# Altium schematic sheet Sheet3_MCU.SchDoc: =ProjectName
size A4; DocumentNumber: 3; SheetNumber: 3; SheetTotal: 5
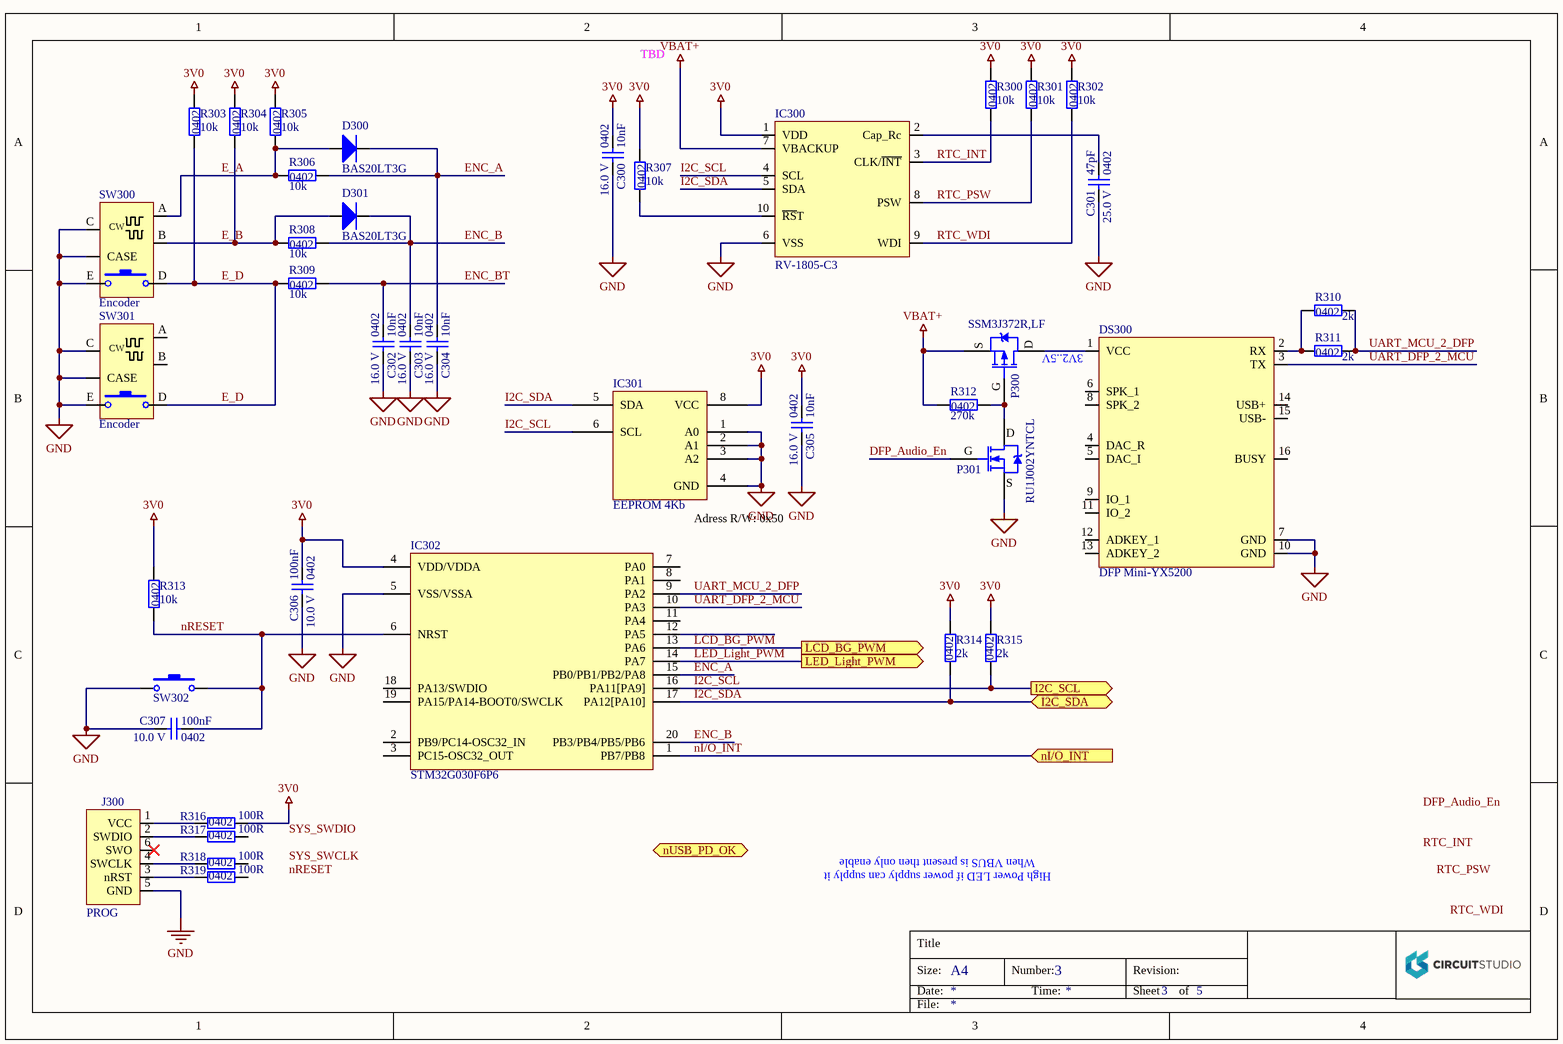
[diagram p0: Sheet3_MCU.SchDoc]

## Parts
C300  Capacitance: 10nF  Footprint: 0402  Voltage: 16.0 V  [C_0402]  (hidden comment: C 10nF 0402 16V)
C301  Capacitance: 47pF  Footprint: 0402  Voltage: 25.0 V  [C_0402]  (hidden comment: C 47pF 0402 25V)
C302  Capacitance: 10nF  Footprint: 0402  Voltage: 16.0 V  [C_0402]  (hidden comment: C 10nF 0402 16V)
C303  Capacitance: 10nF  Footprint: 0402  Voltage: 16.0 V  [C_0402]  (hidden comment: C 10nF 0402 16V)
C304  Capacitance: 10nF  Footprint: 0402  Voltage: 16.0 V  [C_0402]  (hidden comment: C 10nF 0402 16V)
C305  Capacitance: 10nF  Footprint: 0402  Voltage: 16.0 V  [C_0402]  (hidden comment: C 10nF 0402 16V)
C306  Capacitance: 100nF  Footprint: 0402  Voltage: 10.0 V  [C_0402]  (hidden comment: C 100nF 0402 10V)
C307  Capacitance: 100nF  Footprint: 0402  Voltage: 10.0 V  [C_0402]  (hidden comment: C 100nF 0402 10V)
D300  BAS20LT3G  [SOT-23-3]
D301  BAS20LT3G  [SOT-23-3]
DS300  DFP Mini-YX5200  [DFP_Player_Mini]
IC300  RV-1805-C3  [SON-6]
IC301  EEPROM 4Kb  [TSSOP-8_4.4mm]
IC302  STM32G030F6P6  [TSSOP-20]
J300  PROG  [J_TC2030-IDC-FP]
P300  Manufacturer Part Number: SSM3J372R,LF  [SOT-23-3-F]  (hidden comment: P PMOS 30V 6A)
P301  Manufacturer Part Number: RU1J002YNTCL  [UMT3F]  (hidden comment: P_NCH_50V_150mW)
R300  Resistance: 10k  Footprint: 0402  [R_0402]  (hidden comment: R 10k 0402)
R301  Resistance: 10k  Footprint: 0402  [R_0402]  (hidden comment: R 10k 0402)
R302  Resistance: 10k  Footprint: 0402  [R_0402]  (hidden comment: R 10k 0402)
R303  Resistance: 10k  Footprint: 0402  [R_0402]  (hidden comment: R 10k 0402)
R304  Resistance: 10k  Footprint: 0402  [R_0402]  (hidden comment: R 10k 0402)
R305  Resistance: 10k  Footprint: 0402  [R_0402]  (hidden comment: R 10k 0402)
R306  Resistance: 10k  Footprint: 0402  [R_0402]  (hidden comment: R 10k 0402)
R307  Resistance: 10k  Footprint: 0402  [R_0402]  (hidden comment: R 10k 0402)
R308  Resistance: 10k  Footprint: 0402  [R_0402]  (hidden comment: R 10k 0402)
R309  Resistance: 10k  Footprint: 0402  [R_0402]  (hidden comment: R 10k 0402)
R310  Resistance: 2k  Footprint: 0402  [R_0402]  (hidden comment: R 2k 0402)
R311  Resistance: 2k  Footprint: 0402  [R_0402]  (hidden comment: R 2k 0402)
R312  Resistance: 270k  Footprint: 0402  [R_0402]  (hidden comment: R 270k 0402)
R313  Resistance: 10k  Footprint: 0402  [R_0402]  (hidden comment: R 10k 0402)
R314  Resistance: 2k  Footprint: 0402  [R_0402]  (hidden comment: R 2k 0402)
R315  Resistance: 2k  Footprint: 0402  [R_0402]  (hidden comment: R 2k 0402)
R316  Resistance: 100R  Footprint: 0402  [R_0402]  (hidden comment: R 100R 0402)
R317  Resistance: 100R  Footprint: 0402  [R_0402]  (hidden comment: R 100R 0402)
R318  Resistance: 100R  Footprint: 0402  [R_0402]  (hidden comment: R 100R 0402)
R319  Resistance: 100R  Footprint: 0402  [R_0402]  (hidden comment: R 100R 0402)
SW300  Encoder  [PEC11R]
SW301  Encoder  [PEC11R]
SW302  SW  [SW_PTS810]  (value not drawn)

## Ports
I2C_SCL (out), I2C_SDA (bidir), LCD_BG_PWM (out), LED_Light_PWM (out), nI/O_INT (in), nUSB_PD_OK (in)

## Nets
3V0: C300.2 C305.2 C306.2 IC300.1(VDD) IC301.8(VCC) IC302.4(VDD/VDDA) R300.2 R301.2 R302.2 R303.2 R304.2 R305.2 R307.2 R313.2 R314.2 R315.2 R316.2
GND: C300.1 C301.1 C302.1 C303.1 C304.1 C305.1 C306.1 C307.1 DS300.7(GND) DS300.10(GND) IC300.6(VSS) IC301.1(A0) IC301.2(A1) IC301.3(A2) IC301.4(GND) IC302.5(VSS/VSSA) J300.5(GND) P301.2(S) SW300.C SW300.CASE SW300.E SW301.C SW301.CASE SW301.E SW302.1(1,_2)
VBAT+: IC300.7(VBACKUP) P300.2(S) R312.2
DFP_Audio_En: P301.1(G)
E_A: D300.1(A) R305.1 R306.1 SW300.A
E_B: D301.1(A) R304.1 R308.1 SW300.B
E_D: R303.1 R309.1 SW300.D SW301.D
ENC_A: C304.2 D300.3(K) IC302.15(PB0/PB1/PB2/PA8) R306.2
ENC_B: C303.2 D301.3(K) IC302.20(PB3/PB4/PB5/PB6) R308.2
ENC_BT: C302.2 R309.2
I2C_SCL: IC300.4(SCL) IC301.6(SCL) IC302.16(PA11[PA9]) R315.1 ; port I2C_SCL
I2C_SDA: IC300.5(SDA) IC301.5(SDA) IC302.17(PA12[PA10]) R314.1 ; port I2C_SDA
LCD_BG_PWM: IC302.13(PA6) ; port LCD_BG_PWM
LED_Light_PWM: IC302.14(PA7) ; port LED_Light_PWM
nI/O_INT: IC302.1(PB7/PB8) ; port nI/O_INT
nRESET: C307.2 IC302.6(NRST) R313.1 SW302.3(2,_3)
RTC_INT: IC300.3(CLK/~{INT}) R300.1
RTC_PSW: IC300.8(PSW) R301.1
RTC_WDI: IC300.9(WDI) R302.1
UART_DFP_2_MCU: DS300.3(TX) IC302.10(PA3)
UART_MCU_2_DFP: IC302.9(PA2) R310.1 R311.1
NetC301_2: C301.2 IC300.2(Cap_Rc)
NetDS300_1: DS300.1(VCC) P300.3(D)
NetDS300_2: DS300.2(RX) R310.2 R311.2
NetIC300_10: IC300.10(~{RS}T) R307.1
NetJ300_1: J300.1(VCC) R316.1
NetJ300_2: J300.2(SWDIO) R317.1
NetJ300_3: J300.3(nRST) R319.1
NetJ300_4: J300.4(SWCLK) R318.1
NetP300_1: P300.1(G) P301.3(D) R312.1

Not connected (* = marked no-connect by the designer): DS300 4(DAC_R) 5(DAC_I) 6(SPK_1) 8(SPK_2) 9(IO_1) 11(IO_2) 12(ADKEY_1) 13(ADKEY_2) 14(USB+) 15(USB-) 16(BUSY); IC302 2(PB9/PC14-OSC32_IN) 3(PC15-OSC32_OUT) 7(PA0) 8(PA1) 11(PA4) 12(PA5) 18(PA13/SWDIO) 19(PA15/PA14-BOOT0/SWCLK); J300 6(SWO)*; R317 2; R318 2; R319 2; SW301 A B

## Notes on the sheet
- TBD
- 3V2..5V
- Adress R/W: 0x50
- When VBUS is present then only enable
- High Power LED if power supply can supply it
- Labels drawn without touching a wire or pin: DFP_Audio_En, nRESET, RTC_INT, RTC_PSW, RTC_WDI, SYS_SWCLK, SYS_SWDIO
- Title
- Size:
- Date:
- A4
- Number:
- Time:
- Revision:
- Sheet
- of
- File:
- (in symbol ENC_12_THT) CW

## Library data of the parts
C300 C302-C305 = CAP_10nF_16V_0402: CAP CER 10000PF 16V Y5V 0402; Manufacturer: Samsung Electro-Mechanics; Manufacturer Part Number: CL05F103ZO5NNNC; Type: Capacitor; Supplier 1: Digi-Key; Supplier Part Number 1: 1276-1738-1-ND
C301 = CAP_47pF_25V_0402: CAP CER 47PF 25V C0G/NP0 0402; Manufacturer: KEMET; Manufacturer Part Number: C0402C470J3GAC7867; Type: Capacitor; Supplier 1: Digi-Key; Supplier Part Number 1: 399-C0402C470J3GAC7867CT-ND
C306 C307 = CAP_100nF_10V_0402: CAP CER 0.1UF 10V X5R 0402; Manufacturer: Samsung Electro-Mechanics; Manufacturer Part Number: CL05A104MP5NNNC; Type: Capacitor; Supplier 1: Digi-Key; Supplier Part Number 1: 1276-1443-1-ND
D300 D301 = D_LL_200V_200mA: DIODE GP 200V 200MA SOT23-3; Manufacturer: onsemi; Type: Diode; Supplier 1: Digi-Key; Supplier Part Number 1: BAS20LT3GOSCT-ND; Manufacturer Part Number: BAS20LT3G
DS300 = DFP_Player_mini: Mini-YX5200 Audio MP3 Modul; Manufacturer: DFRobot; Manufacturer Part Number: DFR0299; Type: other; Supplier 1: AliExpress; Supplier Part Number 1: 33036928283
IC300 = IC_RTC_1805-C3: IC RTC CLK/CALENDAR I2C 10SON; Manufacturer: Micro Crystal AG; Manufacturer Part Number: RV-1805-C3-32.768KHZ-2PPM-TA-QA; Type: IC, RTC; Supplier 1: Digi-Key; Supplier Part Number 1: 2195-RV-1805-C3-32.768KHZ-2PPM-TA-QATR-ND
IC301 = IC_EEPROM_4Kb: IC EEPROM 4KBIT I2C 1MHZ 8TSSOP; Manufacturer: Microchip Technology; Manufacturer Part Number: AT34C04-X5M-T; Type: IC, EEPROM; Supplier 1: Digi-Key; Supplier Part Number 1: AT34C04-X5M-TCT-ND
IC302 = IC_MCU_STM32G030F6P6: IC MCU 32BIT 32KB FLASH 20TSSOP; Manufacturer: STMicroelectronics; Manufacturer Part Number: STM32G030F6P6; Type: IC, MCU; Supplier 1: JLCPCB; Supplier Part Number 1: C724040
J300 = J_TC2030-IDC-FP: SWD Programmer; Manufacturer: Tag_connect; Manufacturer Part Number: TC2030; Type: Connector; Pins: 3
P300 = P_PCH_30V_1W: MOSFET P-CH 30V 6A SOT23F; Manufacturer: Toshiba Semiconductor and Storage; Type: Transistor; Supplier 1: Digi-Key; Supplier Part Number 1: SSM3J372RLFCT-ND
P301 = P_NCH_50V_150mW: MOSFET N-CH 50V 200MA UMT3F; Manufacturer: Rohm Semiconductor; Type: Transistor; Supplier 1: Digi-Key; Supplier Part Number 1: RU1J002YNTCLCT-ND
R300-R309 R313 = R_10k_0402: RES 10K OHM 1% 1/16W 0402; Manufacturer: YAGEO; Manufacturer Part Number: RC0402FR-0710KL; Type: Resistor; Supplier 1: Digi-Key; Supplier Part Number 1: 311-10.0KLRCT-ND
R310 R311 R314 R315 = R_2k_0402: RES 2K OHM 1% 1/16W 0402; Manufacturer: Stackpole Electronics Inc; Manufacturer Part Number: RMCF0402FT2K00; Type: Resistor; Supplier 1: Digi-Key; Supplier Part Number 1: RMCF0402FT2K00CT-ND
R312 = R_270k_0402: RES 270K OHM 1% 1/16W 0402; Manufacturer: YAGEO; Manufacturer Part Number: RC0402FR-07270KL; Type: Resistor; Supplier 1: Digi-Key; Supplier Part Number 1: 311-270KLRCT-ND
R316-R319 = R_100R_0402: RES 100 OHM 1% 1/16W 0402; Manufacturer: Stackpole Electronics Inc; Manufacturer Part Number: RMCF0402FT100R; Type: Resistor; Supplier 1: Digi-Key; Supplier Part Number 1: RMCF0402FT100RCT-ND
SW300 SW301 = ENC_12_THT: ROTARY ENCODER MECHANICAL 12PPR; Manufacturer: Bourns Inc.; Manufacturer Part Number: PEC11R-4220F-S0012; Supplier 1: Digi-Key; Supplier Part Number 1: PEC11R-4220F-S0012-ND; Type: other, Encoder
SW302 = SW_TactileSW_V: SWITCH TACTILE SPST-NO 0.05A 16V; Manufacturer: C&K; Manufacturer Part Number: PTS810 SJM 250 SMTR LFS; Type: Resistor; Supplier 1: Digi-Key; Supplier Part Number 1: CKN10502CT-ND